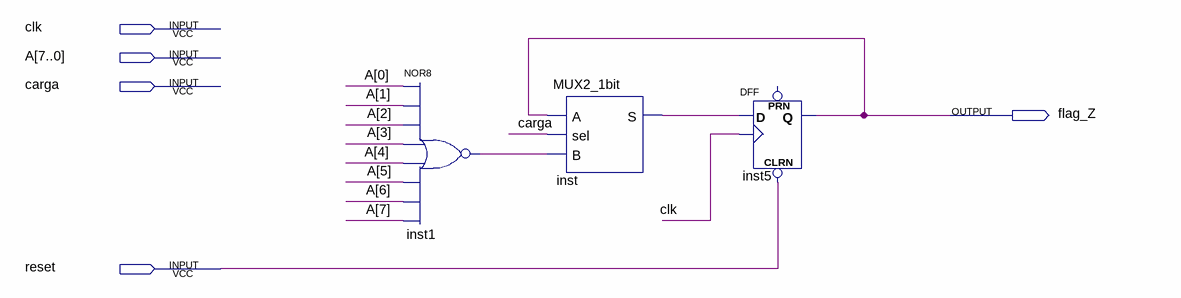
[diagram p0: schematic sheet]
// Quartus schematic FLAG_Z.bdf as structural Verilog: 3 symbols, 5 pins
module FLAG_Z (
  input  clk,
  input  [7:0] A,
  input  carga,
  input  reset,
  output flag_Z
);

  wire inst1_out, inst_s;

  nor inst1 (inst1_out, A[0], A[1], A[2], A[3], A[4], A[5], A[6], A[7]);
  MUX2_1bit inst (.A(flag_Z), .sel(carga), .B(inst1_out), .S(inst_s));
  DFF inst5 (.CLRN(reset), .CLK(clk), .D(inst_s), .Q(flag_Z));  // open: PRN
endmodule
